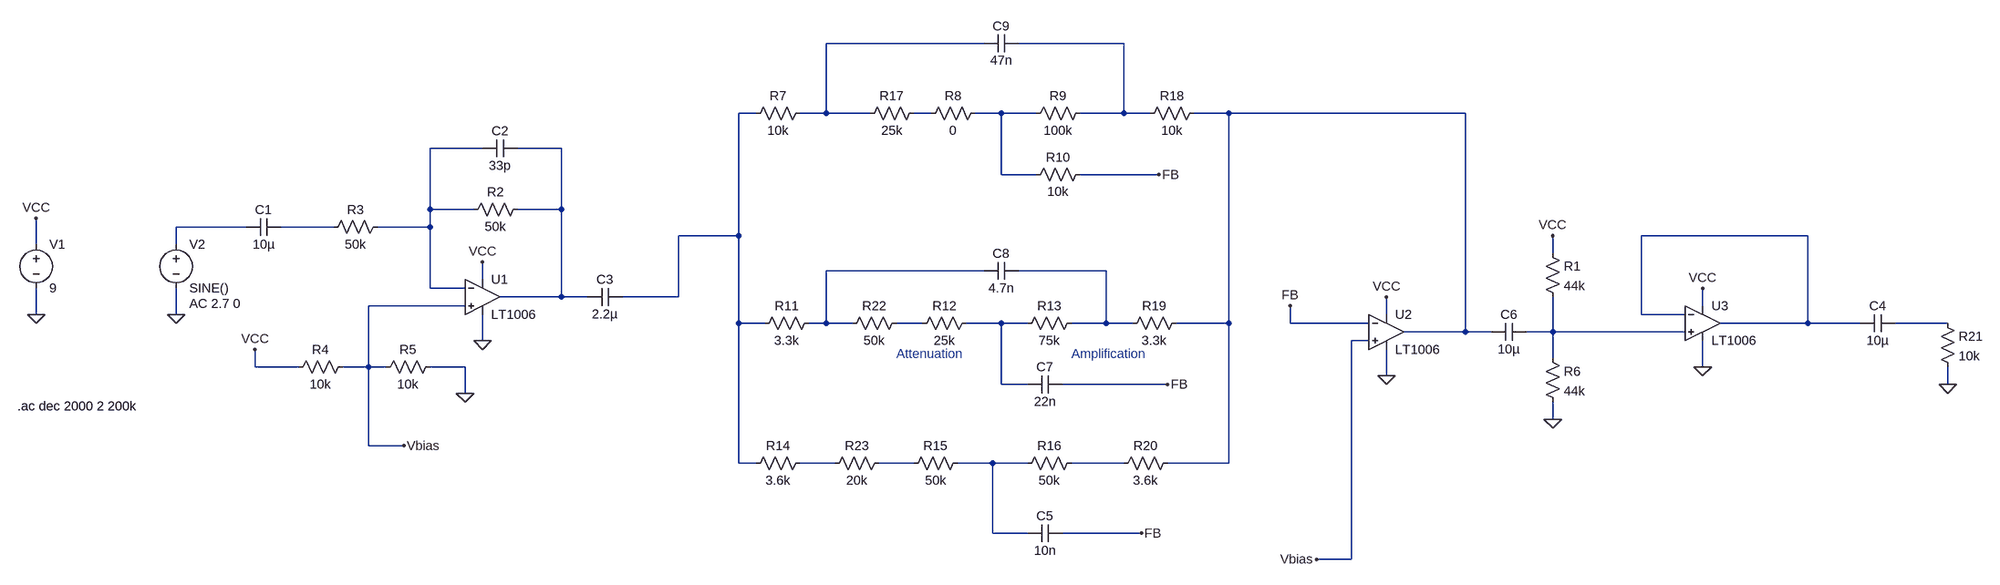
[diagram p0: schematic 3BandEQsimulation.asc]
3BandEQsimulation.asc, the LTspice schematic file:
Version 4
SHEET 1 3748 700
WIRE 1888 -304 1600 -304
WIRE 2144 -304 1952 -304
WIRE 1472 -176 1440 -176
WIRE 1600 -176 1600 -304
WIRE 1600 -176 1552 -176
WIRE 1680 -176 1600 -176
WIRE 1792 -176 1760 -176
WIRE 1920 -176 1872 -176
WIRE 1984 -176 1920 -176
WIRE 2144 -176 2144 -304
WIRE 2144 -176 2064 -176
WIRE 2192 -176 2144 -176
WIRE 2336 -176 2272 -176
WIRE 2768 -176 2336 -176
WIRE 240 -112 144 -112
WIRE 384 -112 304 -112
WIRE 1920 -64 1920 -176
WIRE 1984 -64 1920 -64
WIRE 2208 -64 2064 -64
WIRE 144 0 144 -112
WIRE 224 0 144 0
WIRE 384 0 384 -112
WIRE 384 0 304 0
WIRE -192 32 -320 32
WIRE -32 32 -128 32
WIRE 144 32 144 0
WIRE 144 32 48 32
WIRE 1440 48 1440 -176
WIRE 1440 48 1072 48
WIRE 3424 48 3120 48
WIRE -576 64 -576 16
WIRE -320 64 -320 32
WIRE 2928 80 2928 48
WIRE 1888 112 1600 112
WIRE 2112 112 1952 112
WIRE 240 128 240 96
WIRE 144 144 144 32
WIRE 208 144 144 144
WIRE 384 160 384 0
WIRE 384 160 272 160
WIRE 432 160 384 160
WIRE 1072 160 1072 48
WIRE 1072 160 496 160
WIRE 208 176 32 176
WIRE 3232 176 3232 144
WIRE -576 192 -576 144
WIRE -320 192 -320 144
WIRE 2624 192 2624 160
WIRE 3120 192 3120 48
WIRE 3200 192 3120 192
WIRE 1440 208 1440 48
WIRE 1488 208 1440 208
WIRE 1600 208 1600 112
WIRE 1600 208 1568 208
WIRE 1648 208 1600 208
WIRE 1776 208 1728 208
WIRE 1920 208 1856 208
WIRE 1968 208 1920 208
WIRE 2112 208 2112 112
WIRE 2112 208 2048 208
WIRE 2160 208 2112 208
WIRE 2336 208 2336 -176
WIRE 2336 208 2240 208
WIRE 2448 208 2448 176
WIRE 2592 208 2448 208
WIRE 3424 208 3424 48
WIRE 3424 208 3264 208
WIRE 3520 208 3424 208
WIRE 3680 208 3584 208
WIRE 2768 224 2768 -176
WIRE 2768 224 2656 224
WIRE 2816 224 2768 224
WIRE 2928 224 2928 160
WIRE 2928 224 2880 224
WIRE 3200 224 2928 224
WIRE 240 240 240 192
WIRE 2592 240 2560 240
WIRE 2928 272 2928 224
WIRE -176 288 -176 256
WIRE -96 288 -176 288
WIRE 32 288 32 176
WIRE 32 288 -16 288
WIRE 64 288 32 288
WIRE 208 288 144 288
WIRE 3232 288 3232 240
WIRE 2624 304 2624 256
WIRE 1920 320 1920 208
WIRE 1968 320 1920 320
WIRE 2224 320 2032 320
WIRE 3680 320 3680 288
WIRE 208 336 208 288
WIRE 2928 384 2928 352
WIRE 32 432 32 288
WIRE 96 432 32 432
WIRE 1440 464 1440 208
WIRE 1472 464 1440 464
WIRE 1616 464 1552 464
WIRE 1760 464 1696 464
WIRE 1904 464 1840 464
WIRE 1968 464 1904 464
WIRE 2144 464 2048 464
WIRE 2336 464 2336 208
WIRE 2336 464 2224 464
WIRE 1904 592 1904 464
WIRE 1968 592 1904 592
WIRE 2176 592 2032 592
WIRE 2560 640 2560 240
WIRE 2560 640 2496 640
FLAG 240 240 0
FLAG 208 336 0
FLAG -320 192 0
FLAG -576 192 0
FLAG -576 16 VCC
FLAG -176 256 VCC
FLAG 240 96 VCC
FLAG 2928 384 0
FLAG 2624 160 VCC
FLAG 2624 304 0
FLAG 2176 592 FB
FLAG 2448 176 FB
FLAG 2224 320 FB
FLAG 2208 -64 FB
FLAG 96 432 Vbias
FLAG 2496 640 Vbias
FLAG 3232 144 VCC
FLAG 3232 288 0
FLAG 3680 320 0
FLAG 2928 48 VCC
SYMBOL OpAmps\\LT1006 240 96 R0
SYMATTR InstName U1
SYMBOL cap -128 16 R90
WINDOW 0 0 32 VBottom 2
WINDOW 3 32 32 VTop 2
SYMATTR InstName C1
SYMATTR Value 10µ
SYMBOL cap 304 -128 R90
WINDOW 0 0 32 VBottom 2
WINDOW 3 32 32 VTop 2
SYMATTR InstName C2
SYMATTR Value 33p
SYMBOL cap 496 144 R90
WINDOW 0 0 32 VBottom 2
WINDOW 3 32 32 VTop 2
SYMATTR InstName C3
SYMATTR Value 2.2µ
SYMBOL res 320 -16 R90
WINDOW 0 0 56 VBottom 2
WINDOW 3 32 56 VTop 2
SYMATTR InstName R2
SYMATTR Value 50k
SYMBOL res 64 16 R90
WINDOW 0 0 56 VBottom 2
WINDOW 3 32 56 VTop 2
SYMATTR InstName R3
SYMATTR Value 50k
SYMBOL res 0 272 R90
WINDOW 0 0 56 VBottom 2
WINDOW 3 32 56 VTop 2
SYMATTR InstName R4
SYMATTR Value 10k
SYMBOL res 160 272 R90
WINDOW 0 0 56 VBottom 2
WINDOW 3 32 56 VTop 2
SYMATTR InstName R5
SYMATTR Value 10k
SYMBOL voltage -576 48 R0
WINDOW 123 0 0 Left 0
WINDOW 39 0 0 Left 0
SYMATTR InstName V1
SYMATTR Value 9
SYMBOL voltage -320 48 R0
WINDOW 123 24 124 Left 2
WINDOW 39 0 0 Left 0
SYMATTR InstName V2
SYMATTR Value SINE()
SYMATTR Value2 AC 2.7 0
SYMBOL OpAmps\\LT1006 2624 160 R0
SYMATTR InstName U2
SYMBOL cap 2880 208 R90
WINDOW 0 0 32 VBottom 2
WINDOW 3 32 32 VTop 2
SYMATTR InstName C6
SYMATTR Value 10µ
SYMBOL res 2912 256 R0
SYMATTR InstName R6
SYMATTR Value 44k
SYMBOL res 1568 -192 R90
WINDOW 0 0 56 VBottom 2
WINDOW 3 32 56 VTop 2
SYMATTR InstName R7
SYMATTR Value 10k
SYMBOL res 1888 -192 R90
WINDOW 0 0 56 VBottom 2
WINDOW 3 32 56 VTop 2
SYMATTR InstName R8
SYMATTR Value 0
SYMBOL res 2080 -192 R90
WINDOW 0 0 56 VBottom 2
WINDOW 3 32 56 VTop 2
SYMATTR InstName R9
SYMATTR Value 100k
SYMBOL res 2080 -80 R90
WINDOW 0 0 56 VBottom 2
WINDOW 3 32 56 VTop 2
SYMATTR InstName R10
SYMATTR Value 10k
SYMBOL res 1584 192 R90
WINDOW 0 0 56 VBottom 2
WINDOW 3 32 56 VTop 2
SYMATTR InstName R11
SYMATTR Value 3.3k
SYMBOL res 1872 192 R90
WINDOW 0 0 56 VBottom 2
WINDOW 3 32 56 VTop 2
SYMATTR InstName R12
SYMATTR Value 25k
SYMBOL res 2064 192 R90
WINDOW 0 0 56 VBottom 2
WINDOW 3 32 56 VTop 2
SYMATTR InstName R13
SYMATTR Value 75k
SYMBOL res 1568 448 R90
WINDOW 0 0 56 VBottom 2
WINDOW 3 32 56 VTop 2
SYMATTR InstName R14
SYMATTR Value 3.6k
SYMBOL res 1856 448 R90
WINDOW 0 0 56 VBottom 2
WINDOW 3 32 56 VTop 2
SYMATTR InstName R15
SYMATTR Value 50k
SYMBOL res 2064 448 R90
WINDOW 0 0 56 VBottom 2
WINDOW 3 32 56 VTop 2
SYMATTR InstName R16
SYMATTR Value 50k
SYMBOL cap 2032 576 R90
WINDOW 0 0 32 VBottom 2
WINDOW 3 32 32 VTop 2
SYMATTR InstName C5
SYMATTR Value 10n
SYMBOL cap 2032 304 R90
WINDOW 0 0 32 VBottom 2
WINDOW 3 32 32 VTop 2
SYMATTR InstName C7
SYMATTR Value 22n
SYMBOL cap 1952 96 R90
WINDOW 0 0 32 VBottom 2
WINDOW 3 32 32 VTop 2
SYMATTR InstName C8
SYMATTR Value 4.7n
SYMBOL cap 1952 -320 R90
WINDOW 0 0 32 VBottom 2
WINDOW 3 32 32 VTop 2
SYMATTR InstName C9
SYMATTR Value 47n
SYMBOL res 2288 -192 R90
WINDOW 0 0 56 VBottom 2
WINDOW 3 32 56 VTop 2
SYMATTR InstName R18
SYMATTR Value 10k
SYMBOL res 2256 192 R90
WINDOW 0 0 56 VBottom 2
WINDOW 3 32 56 VTop 2
SYMATTR InstName R19
SYMATTR Value 3.3k
SYMBOL res 2240 448 R90
WINDOW 0 0 56 VBottom 2
WINDOW 3 32 56 VTop 2
SYMATTR InstName R20
SYMATTR Value 3.6k
SYMBOL OpAmps\\LT1006 3232 144 R0
SYMATTR InstName U3
SYMBOL res 3664 192 R0
SYMATTR InstName R21
SYMATTR Value 10k
SYMBOL res 2912 64 R0
SYMATTR InstName R1
SYMATTR Value 44k
SYMBOL cap 3584 192 R90
WINDOW 0 0 32 VBottom 2
WINDOW 3 32 32 VTop 2
SYMATTR InstName C4
SYMATTR Value 10µ
SYMBOL res 1776 -192 R90
WINDOW 0 0 56 VBottom 2
WINDOW 3 32 56 VTop 2
SYMATTR InstName R17
SYMATTR Value 25k
SYMBOL res 1744 192 R90
WINDOW 0 0 56 VBottom 2
WINDOW 3 32 56 VTop 2
SYMATTR InstName R22
SYMATTR Value 50k
SYMBOL res 1712 448 R90
WINDOW 0 0 56 VBottom 2
WINDOW 3 32 56 VTop 2
SYMATTR InstName R23
SYMATTR Value 20k
TEXT -610 360 Left 2 !.ac dec 2000 2 200k
TEXT 2048 264 Left 2 ;Amplification
TEXT 1728 264 Left 2 ;Attenuation

The netlist it stands for:
* 3BandEQsimulation.asc
XU1 Vbias N007 VCC 0 N008 LT1006  ; pins In+ In- V+ V- OUT
C1 N010 N009 10µ
C2 N008 N007 33p
C3 N003 N008 2.2µ
R2 N008 N007 50k
R3 N007 N010 50k
R4 Vbias VCC 10k
R5 0 Vbias 10k
V1 VCC 0 9
V2 N009 0 SINE() AC 2.7 0
XU2 Vbias FB VCC 0 N006 LT1006  ; pins In+ In- V+ V- OUT
C6 N017 N006 10µ
R6 N017 0 44k
R7 N001 N003 10k
R8 N005 N004 0
R9 N002 N005 100k
R10 FB N005 10k
R11 N012 N003 3.3k
R12 N015 N014 25k
R13 N013 N015 75k
R14 N018 N003 3.6k
R15 N020 N019 50k
R16 N021 N020 50k
C5 FB N020 10n
C7 FB N015 22n
C8 N013 N012 4.7n
C9 N002 N001 47n
R18 N006 N002 10k
R19 N006 N013 3.3k
R20 N006 N021 3.6k
XU3 N017 N011 VCC 0 N011 LT1006  ; pins In+ In- V+ V- OUT
R21 N016 0 10k
R1 VCC N017 44k
C4 N016 N011 10µ
R17 N004 N001 25k
R22 N014 N012 50k
R23 N019 N018 20k
.ac dec 2000 2 200k
* Amplification
* Attenuation
.lib LTC.lib
.backanno
.end